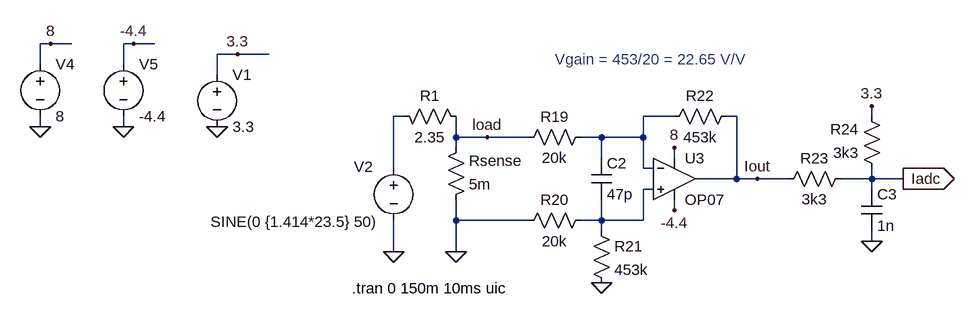
[diagram p0: schematic Current Sense.asc]
Current Sense.asc, the LTspice schematic file:
Version 4
SHEET 1 1792 680
WIRE -48 -288 -64 -288
WIRE -16 -288 -48 -288
WIRE 80 -288 64 -288
WIRE 112 -288 80 -288
WIRE 240 -272 208 -272
WIRE 288 -272 240 -272
WIRE -64 -256 -64 -288
WIRE 64 -256 64 -288
WIRE 208 -240 208 -272
WIRE 496 -176 480 -176
WIRE 912 -176 864 -176
WIRE 1008 -176 992 -176
WIRE 1216 -176 1216 -192
WIRE -64 -160 -64 -176
WIRE 64 -160 64 -176
WIRE 576 -144 576 -176
WIRE 624 -144 576 -144
WIRE 688 -144 624 -144
WIRE 800 -144 768 -144
WIRE 864 -144 864 -176
WIRE 864 -144 800 -144
WIRE 576 -128 576 -144
WIRE 800 -112 800 -144
WIRE 912 -112 912 -128
WIRE 480 -96 480 -176
WIRE 864 -96 864 -144
WIRE 880 -96 864 -96
WIRE 1008 -80 1008 -176
WIRE 1008 -80 944 -80
WIRE 1040 -80 1008 -80
WIRE 1088 -80 1040 -80
WIRE 1216 -80 1216 -96
WIRE 1216 -80 1168 -80
WIRE 1264 -80 1216 -80
WIRE 880 -64 864 -64
WIRE 1216 -64 1216 -80
WIRE 912 -32 912 -48
WIRE 576 -16 576 -48
WIRE 688 -16 576 -16
WIRE 800 -16 800 -48
WIRE 800 -16 768 -16
WIRE 864 -16 864 -64
WIRE 864 -16 800 -16
WIRE 800 0 800 -16
WIRE 1216 16 1216 0
WIRE 480 32 480 -16
WIRE 576 32 576 -16
FLAG 480 32 0
FLAG 576 32 0
FLAG 208 -160 0
FLAG 800 80 0
FLAG -64 -160 0
FLAG 64 -160 0
FLAG -48 -288 8
FLAG 912 -128 8
FLAG 80 -288 -4.4
FLAG 912 -32 -4.4
FLAG 240 -272 3.3
FLAG 1216 -192 3.3
FLAG 1264 -80 Iadc
IOPIN 1264 -80 Out
FLAG 1216 16 0
FLAG 1040 -80 Iout
FLAG 624 -144 load
SYMBOL res 560 -32 M180
WINDOW 0 36 76 Left 2
WINDOW 3 36 40 Left 2
SYMATTR InstName Rsense
SYMATTR Value 5m
SYMBOL voltage 208 -256 R0
WINDOW 123 0 0 Left 0
WINDOW 39 0 0 Left 0
SYMATTR InstName V1
SYMATTR Value 3.3
SYMBOL Opamps\\OP07 912 -144 R0
SYMATTR InstName U3
SYMBOL res 784 -160 R90
WINDOW 0 0 56 VBottom 2
WINDOW 3 32 56 VTop 2
SYMATTR InstName R19
SYMATTR Value 20k
SYMBOL res 784 -32 R90
WINDOW 0 0 56 VBottom 2
WINDOW 3 32 56 VTop 2
SYMATTR InstName R20
SYMATTR Value 20k
SYMBOL cap 784 -112 R0
SYMATTR InstName C2
SYMATTR Value 47p
SYMBOL res 784 -16 R0
SYMATTR InstName R21
SYMATTR Value 453k
SYMBOL res 1008 -192 R90
WINDOW 0 0 56 VBottom 2
WINDOW 3 32 56 VTop 2
SYMATTR InstName R22
SYMATTR Value 453k
SYMBOL voltage -64 -272 R0
WINDOW 123 0 0 Left 0
WINDOW 39 0 0 Left 0
SYMATTR InstName V4
SYMATTR Value 8
SYMBOL voltage 64 -272 R0
WINDOW 123 0 0 Left 0
WINDOW 39 0 0 Left 0
SYMATTR InstName V5
SYMATTR Value -4.4
SYMBOL res 1184 -96 R90
WINDOW 0 0 56 VBottom 2
WINDOW 3 32 56 VTop 2
SYMATTR InstName R23
SYMATTR Value 3k3
SYMBOL res 1232 -80 R180
WINDOW 0 36 76 Left 2
WINDOW 3 36 40 Left 2
SYMATTR InstName R24
SYMATTR Value 3k3
SYMBOL cap 1200 -64 R0
SYMATTR InstName C3
SYMATTR Value 1n
SYMBOL res 480 -192 M90
WINDOW 0 0 56 VBottom 2
WINDOW 3 32 56 VTop 2
SYMATTR InstName R1
SYMATTR Value 2.35
SYMBOL voltage 480 -112 R0
WINDOW 0 -61 13 Left 2
WINDOW 3 -282 98 Left 2
WINDOW 123 0 0 Left 0
WINDOW 39 0 0 Left 0
SYMATTR InstName V2
SYMATTR Value SINE(0 {1.414*23.5} 50)
TEXT 416 88 Left 2 !.tran 0 150m 10ms uic
TEXT 728 -264 Left 2 ;Vgain = 453/20 = 22.65 V/V

The netlist it stands for:
* Current Sense.asc
Rsense 0 load 5m
V1 3.3 0 3.3
XU3 N003 N002 8 -4.4 Iout LT1001  ; OP07, pins In+ In- V+ V- OUT
R19 N002 load 20k
R20 N003 0 20k
C2 N002 N003 47p
R21 N003 0 453k
R22 Iout N002 453k
V4 8 0 8
V5 -4.4 0 -4.4
R23 Iadc Iout 3k3
R24 Iadc 3.3 3k3
C3 Iadc 0 1n
R1 N001 load 2.35
V2 N001 0 SINE(0 {1.414*23.5} 50)
.tran 0 150m 10ms uic
* Vgain = 453/20 = 22.65 V/V
.lib LTC.lib
.backanno
.end